# EAGLE design Patch panel module rev2 (EAGLE 7.2.0)

## Sheet 1 of 2
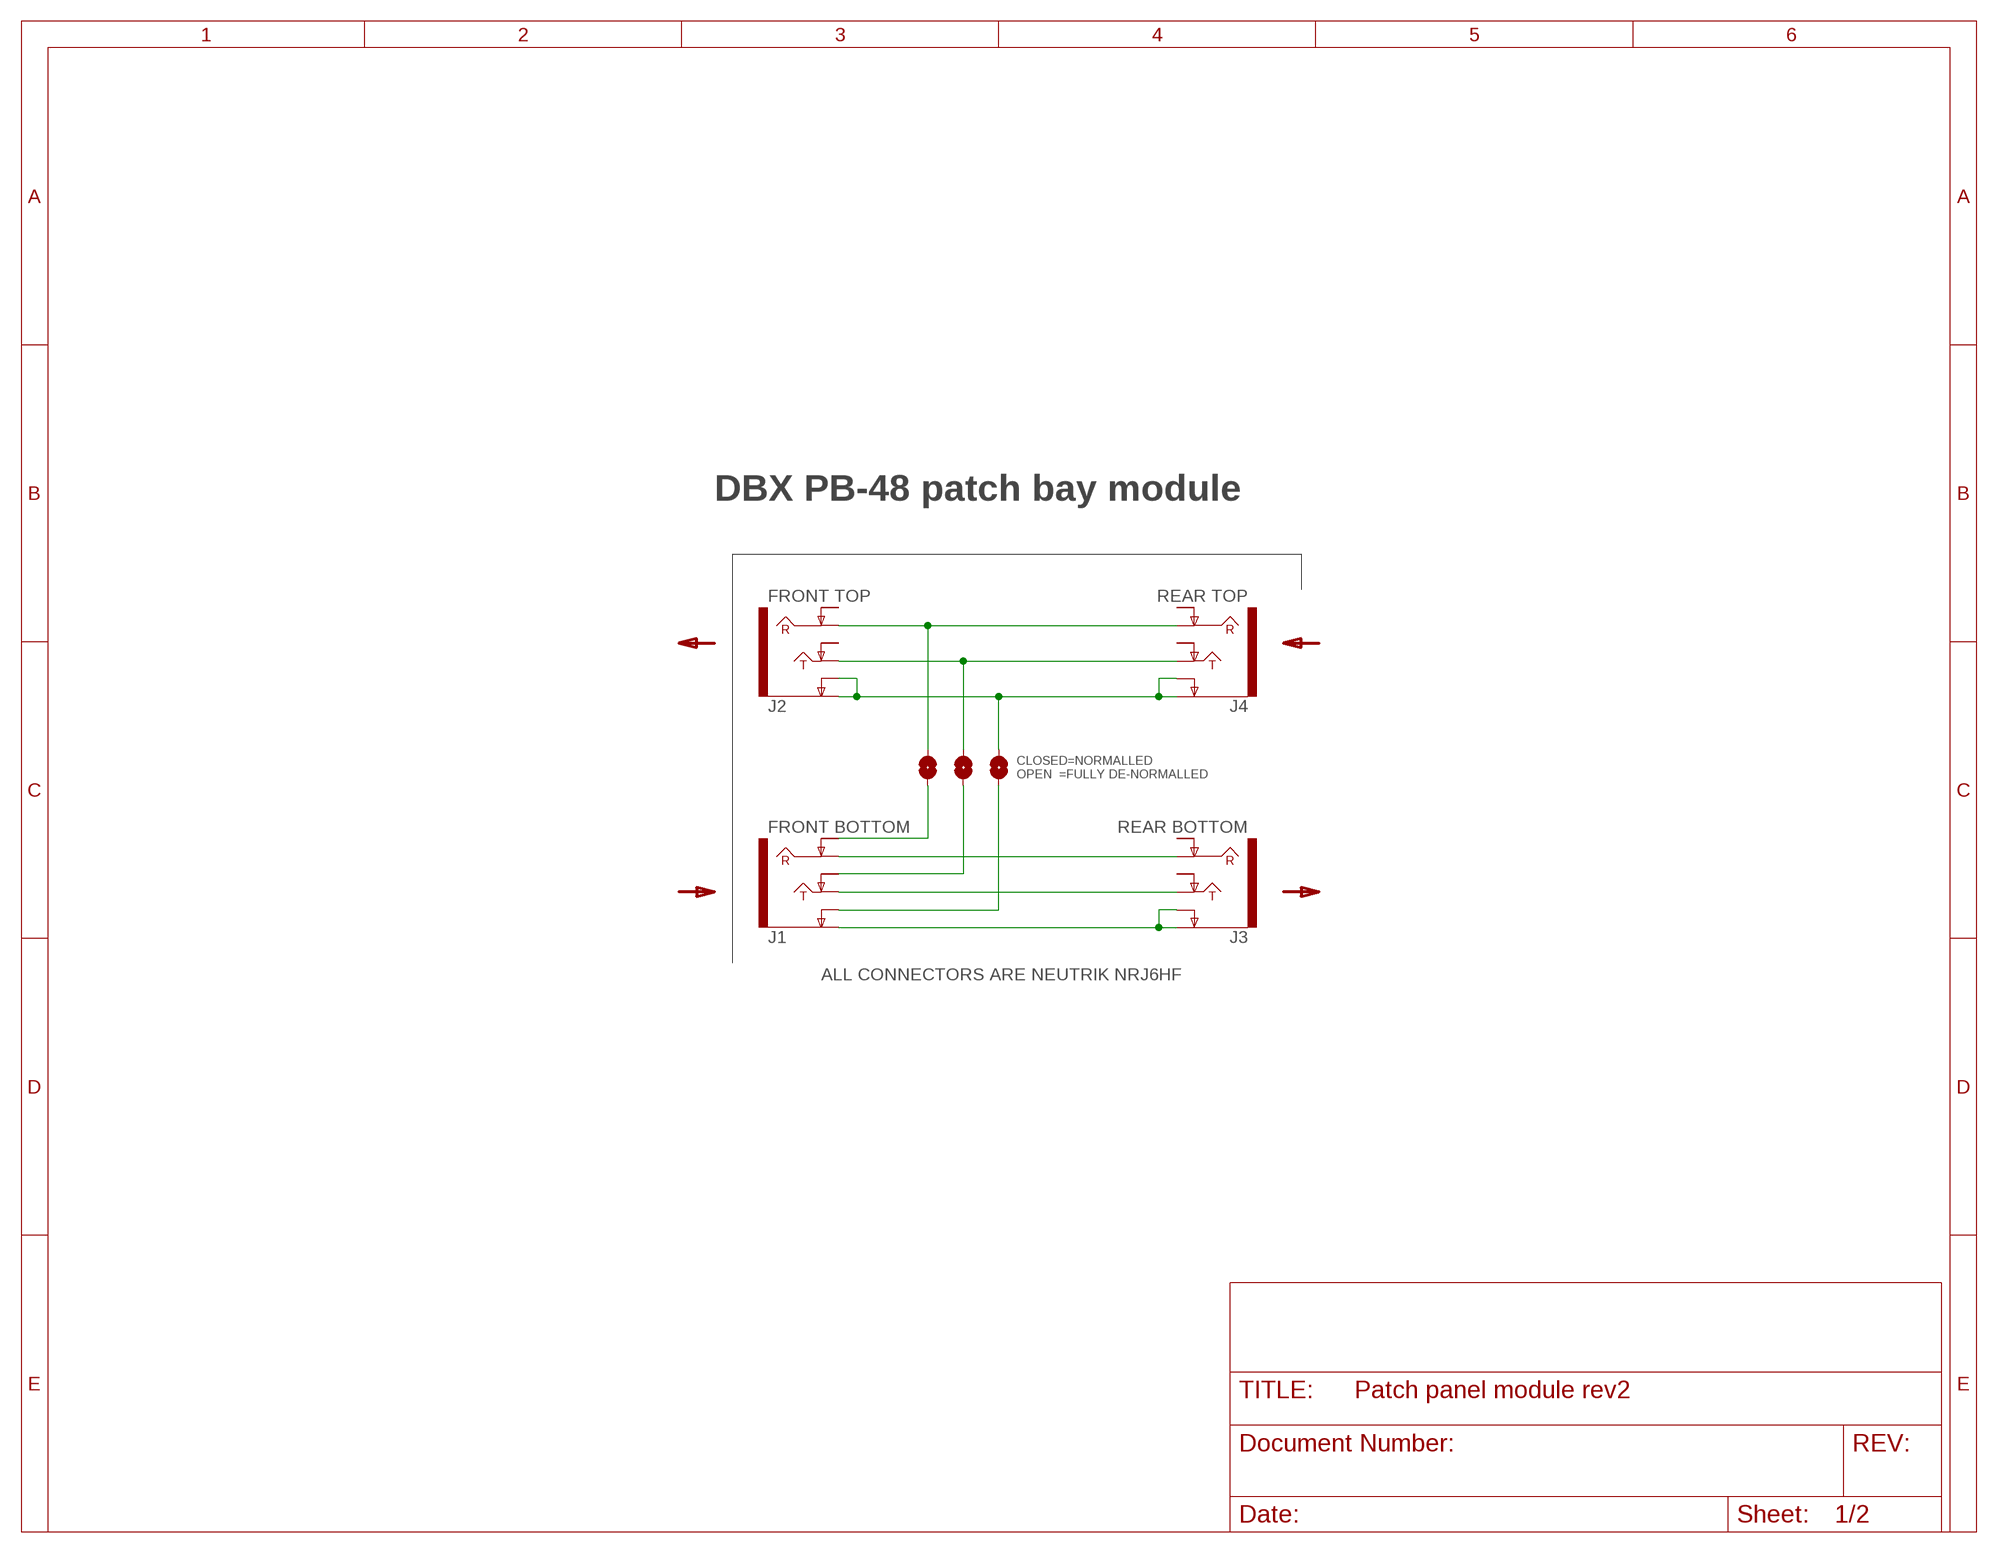
[diagram p0: schematic, sheet 1]

### Parts
J1  FRONT BOTTOM  AUDIO_JACK_TRS_0.25"_PTH_RA-NRJ6HM  [NEUTRIK-NRJ6HF]
J2  FRONT TOP  AUDIO_JACK_TRS_0.25"_PTH_RA-NRJ6HM  [NEUTRIK-NRJ6HF]
J3  REAR BOTTOM  AUDIO_JACK_TRS_0.25"_PTH_RA-NRJ6HM  [NEUTRIK-NRJ6HF]
J4  REAR TOP  AUDIO_JACK_TRS_0.25"_PTH_RA-NRJ6HM  [NEUTRIK-NRJ6HF]
JP1  JUMPER-SMT_2_NO_NO-SILK_ROUND  [SMT-JUMPER_2_NO_NO-SILK_ROUND]
JP2  JUMPER-SMT_2_NO_NO-SILK_ROUND  [SMT-JUMPER_2_NO_NO-SILK_ROUND]
JP3  JUMPER-SMT_2_NO_NO-SILK_ROUND  [SMT-JUMPER_2_NO_NO-SILK_ROUND]

### Nets
N$1: J2.S(EARTH) J2.SN(EARTH-NORM) J4.S(EARTH) J4.SN(EARTH-NORM) JP1.1
N$2: J2.R(RING) J4.R(RING) JP3.1
N$3: J2.T(TIP) J4.T(TIP) JP2.1
N$4: J1.R(RING) J3.R(RING)
N$5: J1.T(TIP) J3.T(TIP)
N$6: J1.S(EARTH) J3.S(EARTH) J3.SN(EARTH-NORM)
N$7: J1.SN(EARTH-NORM) JP1.2
N$8: J1.TN(TIP-NORM) JP2.2
N$9: J1.RN(RING-NORM) JP3.2
Unconnected: J2.RN(RING-NORM) J2.TN(TIP-NORM) J3.RN(RING-NORM) J3.TN(TIP-NORM) J4.RN(RING-NORM) J4.TN(TIP-NORM)

### Notes on the sheet
- DBX PB-48 patch bay module
- CLOSED=NORMALLED
  OPEN  =FULLY DE-NORMALLED
- ALL CONNECTORS ARE NEUTRIK NRJ6HF

## Sheet 2 of 2
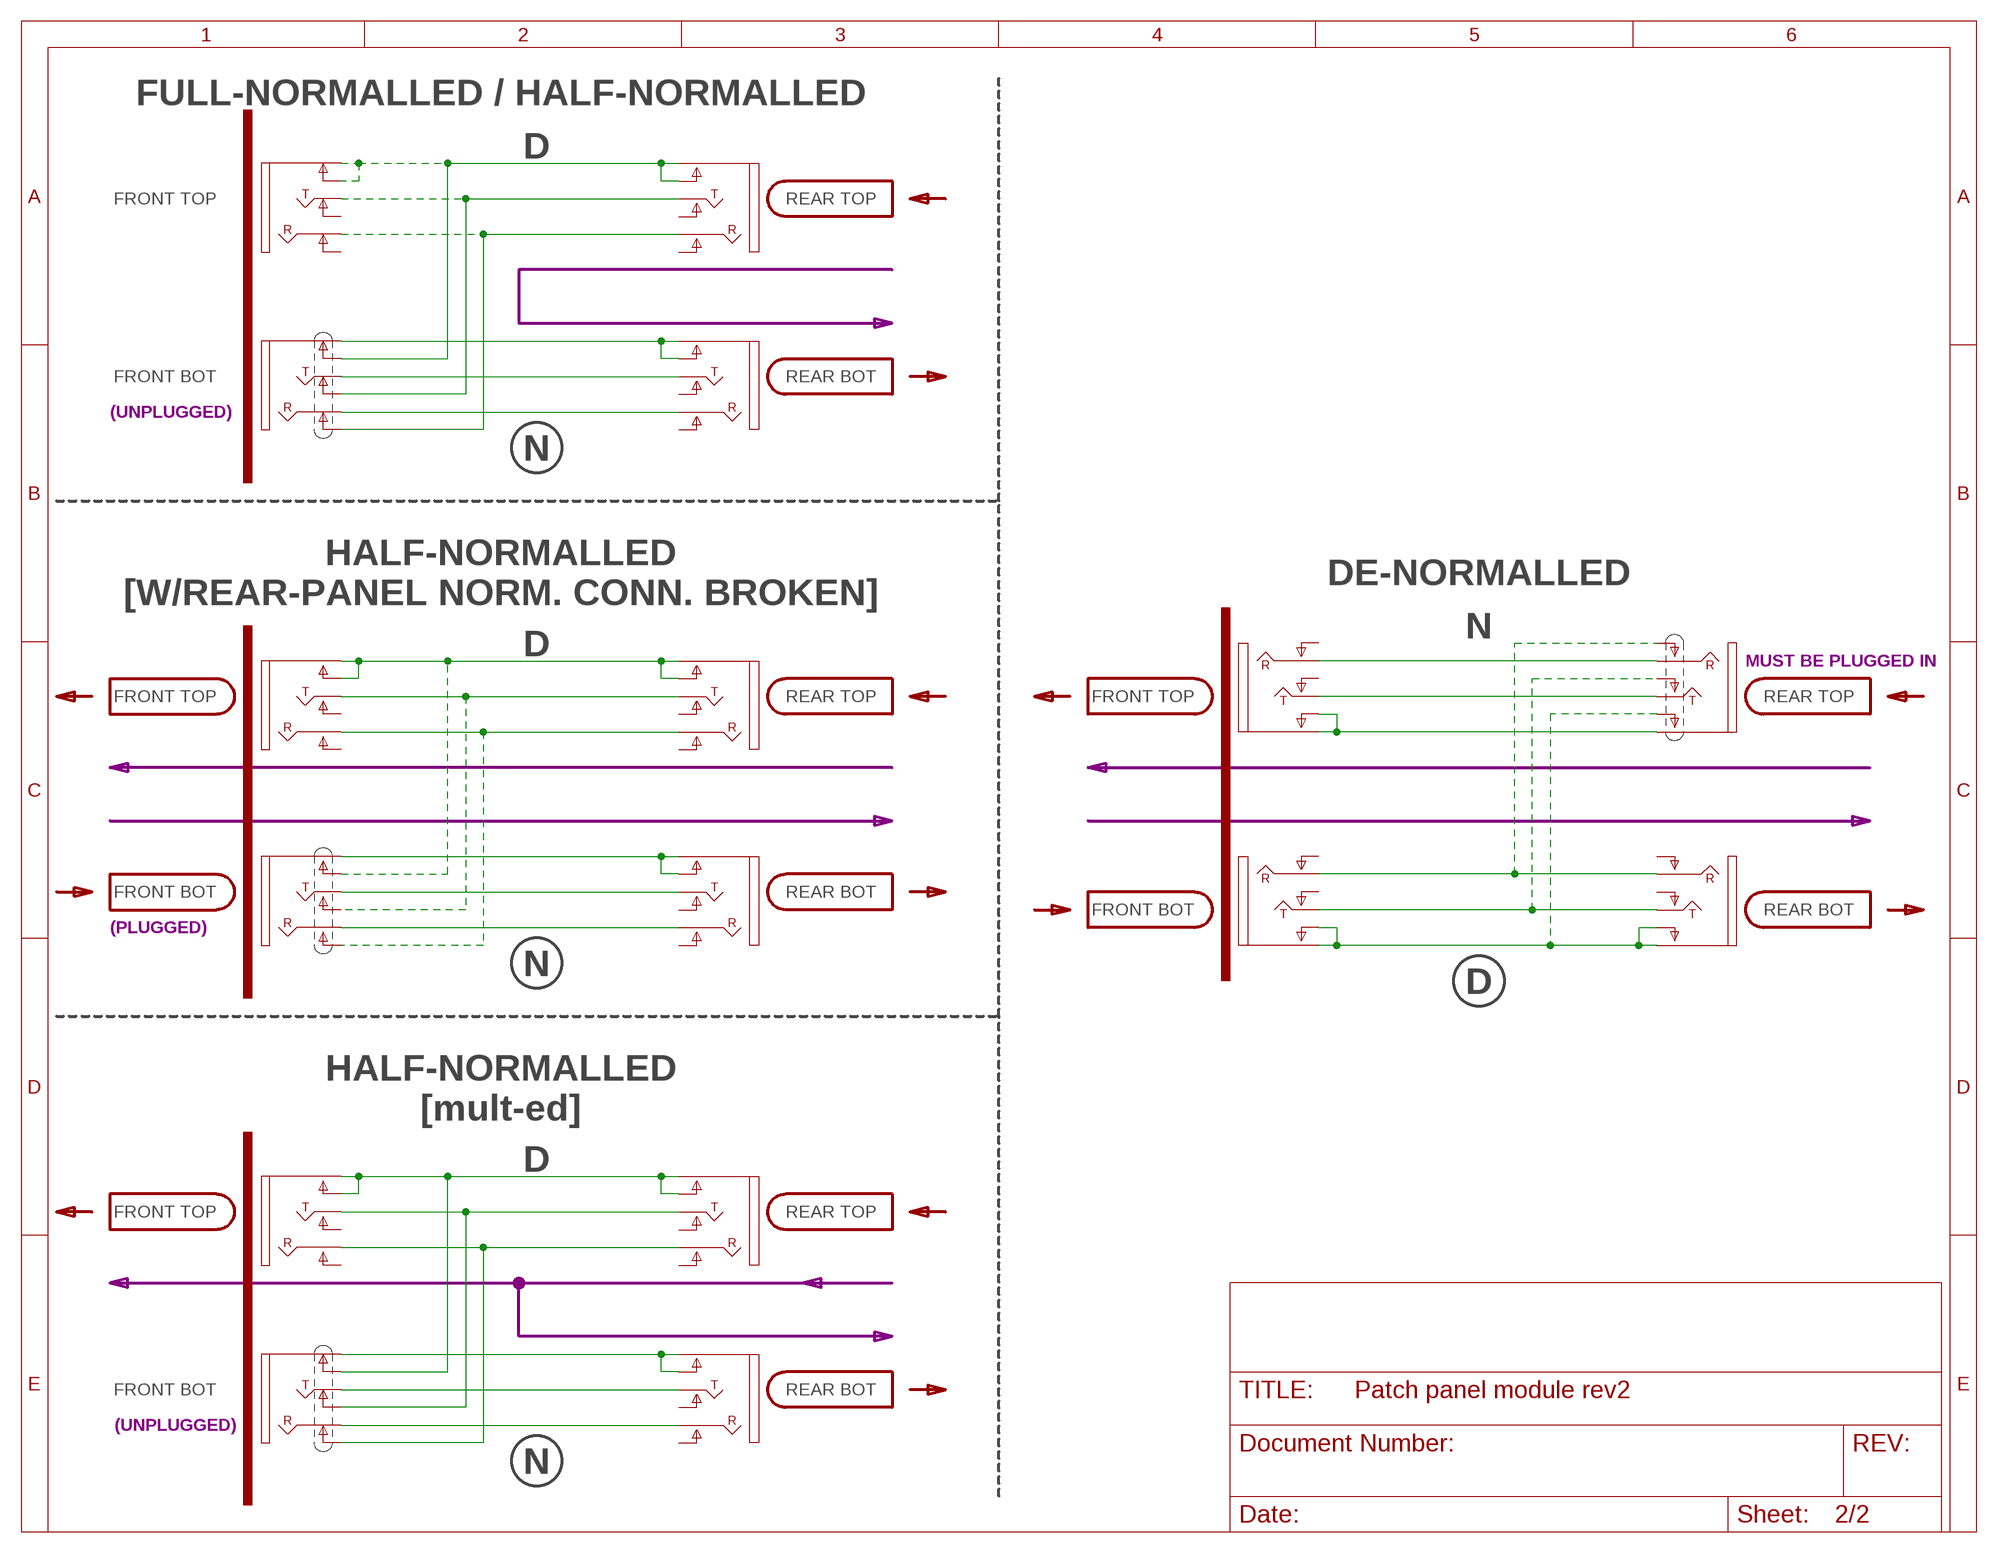
[diagram p1: schematic, sheet 2]

### Notes on the sheet
- FULL-NORMALLED / HALF-NORMALLED
- D
- FRONT TOP | T | T | REAR TOP
- R | R
- FRONT BOT | T | T | REAR BOT
- (UNPLUGGED) | R | R
- N
- HALF-NORMALLED
  [W/REAR-PANEL NORM. CONN. BROKEN]
- DE-NORMALLED
- N
- D
- R | R | MUST BE PLUGGED IN
- FRONT TOP | T | T | REAR TOP | FRONT TOP | T | T | REAR TOP
- R | R
- R | R
- FRONT BOT | T | T | REAR BOT
- FRONT BOT | T | T | REAR BOT
- (PLUGGED) | R | R
- N
- D
- HALF-NORMALLED
  [mult-ed]
- D
- FRONT TOP | T | T | REAR TOP
- R | R
- FRONT BOT | T | T | REAR BOT
- (UNPLUGGED) | R | R
- N

## Library data of the parts
J1-J4 = !frankendeck:AUDIO_JACK_TRS_0.25"_PTH_RA: Audio Jack, 1/4" TRS jack, horizontal, PTH, aka "Phono jack" Find the connector here: Audio Jack - 1/4" Stereo (right angle) <https://www.sparkfun.com/products/11144> (COM-11144) Datasheet <http://cdn.sparkfun.com/datasheets/Components/General/JP-611%20DD.jpg> Note, although the datasheet and physical part are slightly different, this footprint was proven to mate well on the Proto Pedal. This device is used on these SparkFun Products: SparkFun TRS Jack Breakout - 1/4" Stereo <https://www.sparkfun.com/products/13005> (BOB-13005 ) SparkFun Proto Pedal - sorry bad link - product comming soon! <https://www.sparkfun.com/products/13124> (PRT-13124); PROD_ID: CONN-12339; SF_ID: COM-11144
JP1-JP3 = !frankendeck:JUMPER-SMT_2_NO: Normally open jumper This jumper has two pads in close proximity to each other. Apply solder to close the connection. Round pads are easier to solder for beginners, but are a lot larger. SparkFun Product that uses the round pads: SparkFun EL Sequencer <https://www.sparkfun.com/products/12781>

## Board
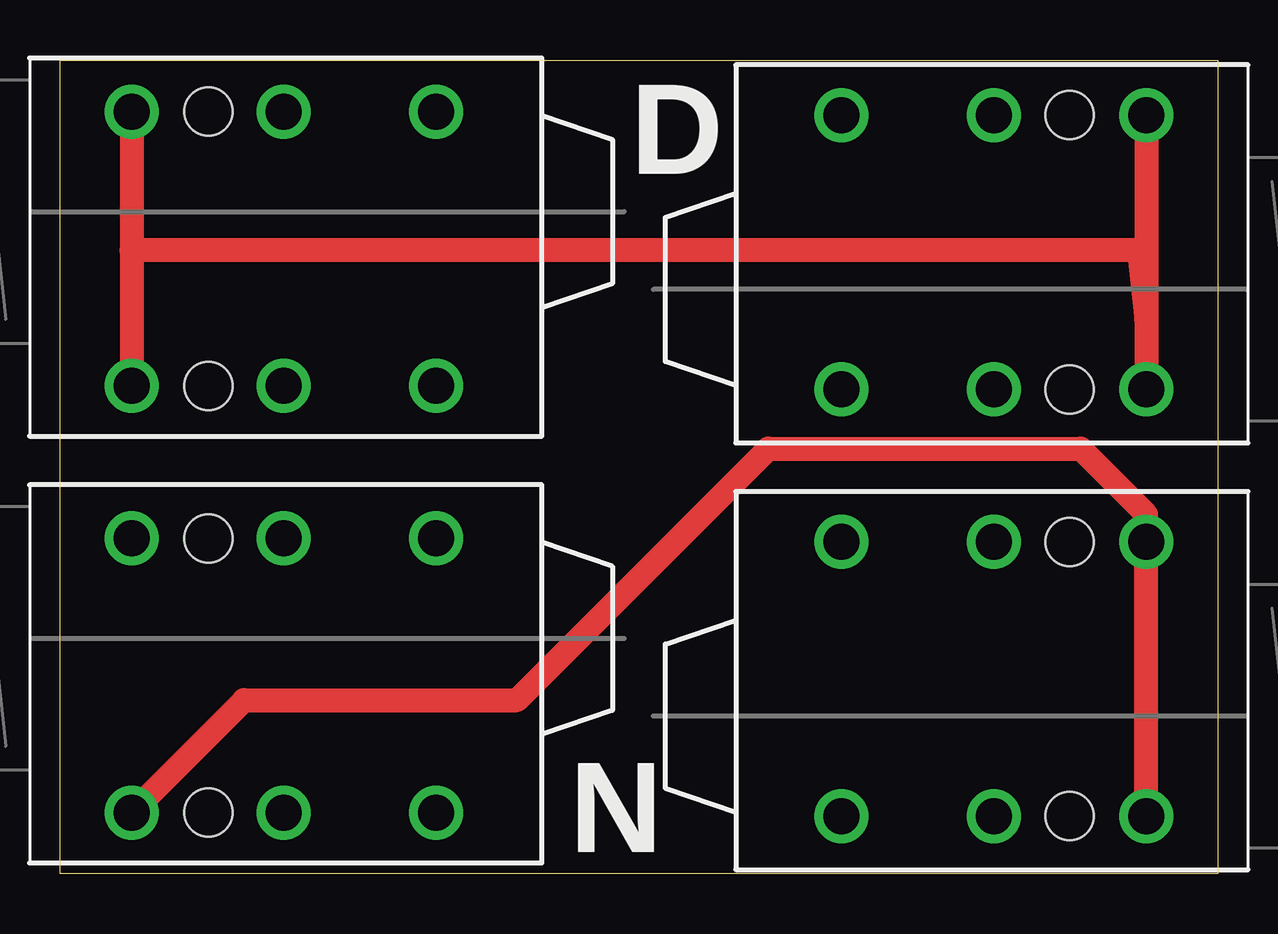
[diagram p2: board, top side]
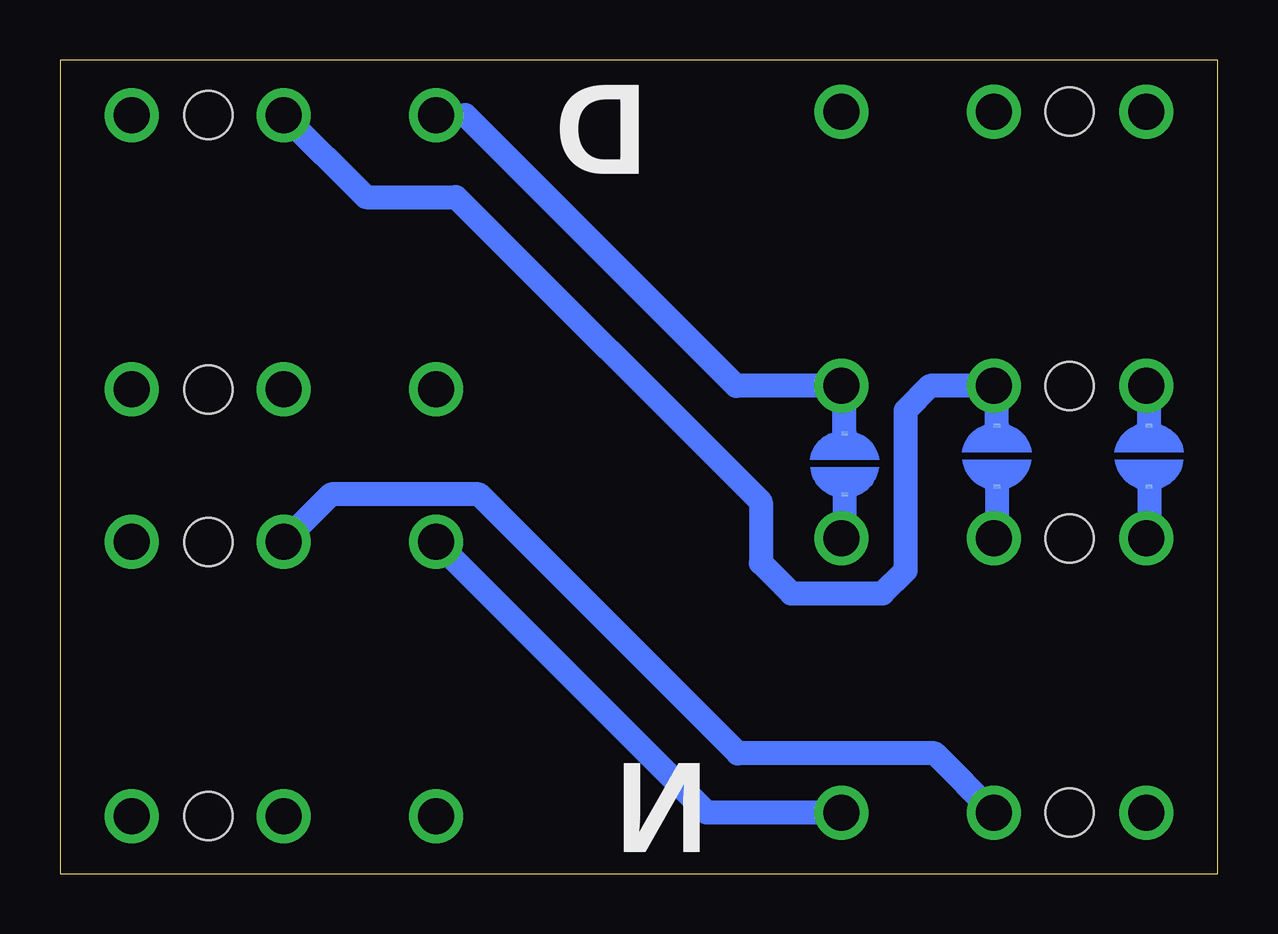
[diagram p3: board, bottom side, seen from below]

Size 48.26 x 33.91 mm. Coordinates in mm from the lower left corner, seen from the top.
Outline: 0,33.91 48.26,33.91 48.26,0 0,0 0,33.91
Copper layers (1*16): Top 0.035559375mm / dielectric 1.6mm / Bottom 0.035559375mm
Design rules "jlcpcb2layer": minimum track width 5mil, minimum drill 12mil, track to track 5mil, track to pad 5mil, pad to pad 5mil, via to via 5mil, smd to smd 5mil, copper to edge 8mil, drill to drill 6mil, minimum pad ring 5mil, minimum via ring 3mil, stop-mask expansion 2.5mil, vias tented up to drill 15mil, thermal gap 10mil

### Footprints (pad centres in the part's own frame; a part is rotated, then mirrored left to right if it is on the bottom)
NEUTRIK-NRJ6HF = drill 1.5: R -10.6,7.23; RN -10.6,-4.2; S -4.25,7.23; SN -4.25,-4.2; T -16.95,7.23; TN -16.95,-4.2 | hole 2: -7.45,7.23; -7.45,-4.2
SMT-JUMPER_2_NO_NO-SILK_ROUND = smd 0.152 x 0.305: 1 -1.27,0; 2 1.27,0

### Placement (x,y rotation side)
J1  -1.27,9.78 180 top
J2  -1.27,27.56 180 top
J3  49.53,6.6 0 top
J4  49.53,24.38 0 top
JP1  2.86,17.4 270 bottom
JP2  15.56,17.08 270 bottom
JP3  9.21,17.4 270 bottom

### Tracks (layer width: path | path; a pad name or v marks a point on that pad's centre or on a via)
N$1
  Top 1: J2.SN 2.98,25.97 | 2.98,25.97 J2.S | J4.S 45.28,23.11 | 45.28,23.11 J4.SN | 2.98,25.97 44.96,25.97 45.28,23.11
  Bottom 1: JP1.1 2.86,20.21 J2.S
N$2
  Bottom 1: JP3.1 9.21,20.21 J2.R 11.99,20.33 13.02,19.3 13.02,12.64 13.97,11.68 17.78,11.68 19.05,12.95 19.05,15.49 31.75,28.19 35.51,28.19 J4.R
N$3
  Bottom 1: JP2.1 15.56,20.21 J2.T 20.07,20.33 31.36,31.61 J4.T
N$4
  Bottom 1: J1.R 11.8,5.02 20,5.02 30.8,15.81 36.95,15.81 J3.R
N$5
  Bottom 1: J1.T 21.3,2.55 J3.T
N$6
  Top 1: J3.SN J3.S 45.28,14.98 42.55,17.72 29.53,17.72 19.05,7.24 7.67,7.24 J1.S
N$7
  Bottom 1: JP1.2 2.86,14.1 J1.SN
N$8
  Bottom 1: JP2.2 15.56,14.1 J1.TN
N$9
  Bottom 1: JP3.2 9.21,14.1 J1.RN

### Text on the board
tPlace: D | N
bPlace: D | N